# EasyEDA Pro project SCH_and_PCB.epro, schematic Schematic1
Create Date: 2023-07-26; Page Name: P1; Project Name: 四路运放; Schematic Name: Schematic1; Update Date: 2023-07-27; Company: 嘉立创EDA; Page Size: A4; Version: V1.0
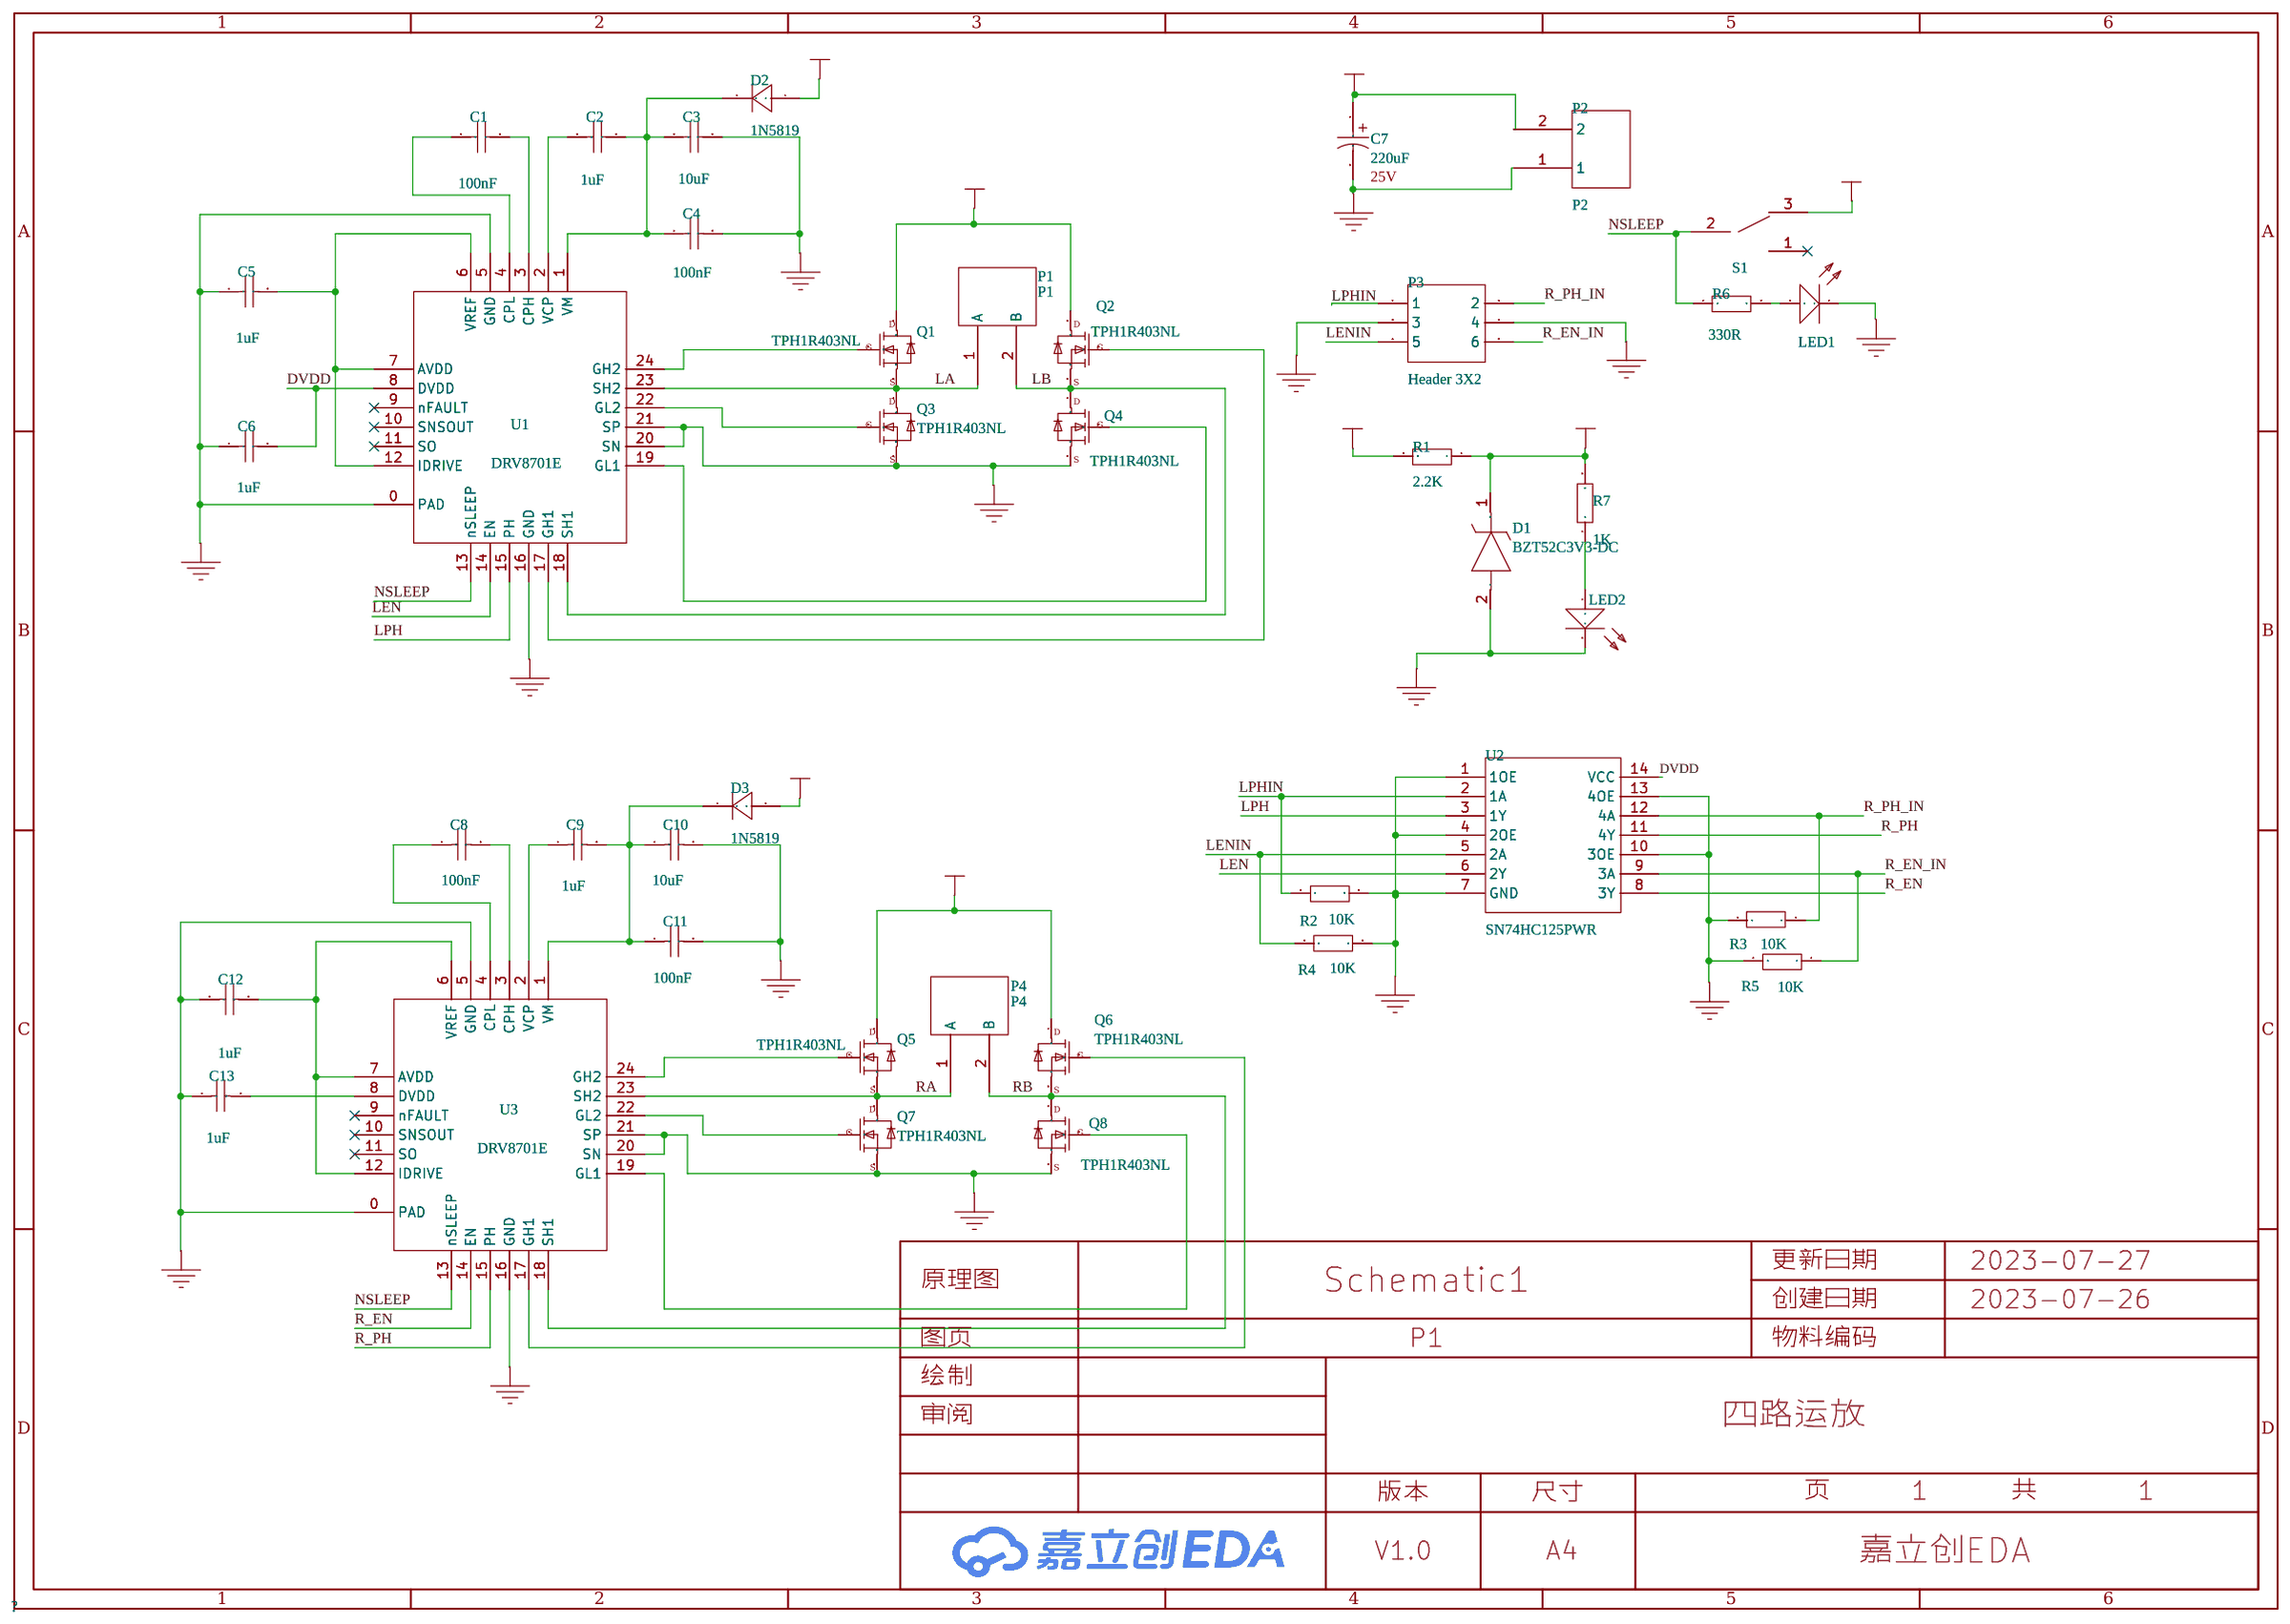
[diagram p0: schematic sheet]

## Parts
C1  100nF  [C 0805_M]
C2  1uF  [C 0805_M]
C3  10uF  [C 0805_M]
C4  100nF  [C 0805_M]
C5  1uF  [C 0805_M]
C6  1uF  [C 0805_M]
C7  220uF  [CAP-D8.0-F3.5]
C8  100nF  [C 0805_M]
C9  1uF  [C 0805_M]
C10  10uF  [C 0805_M]
C11  100nF  [C 0805_M]
C12  1uF  [C 0805_M]
C13  1uF  [C 0805_M]
D1  BZT52C3V3-DC  [SOD3816X140N]
D2  1N5819  [SOD-123]
D3  1N5819  [SOD-123]
LED1  LED 3R  [LED 0805G]
LED2  LED 3R  [LED 0805G]
P1  P1  [KF/WJ/DG 301-2P-5.0MM]
P2  P2  [KF/WJ/DG 301-2P-5.0MM]
P3  Header 3X2  [HDR2.54-LI-2X3P]
P4  P4  [KF/WJ/DG 301-2P-5.0MM]
Q1  TPH1R403NL  [DFN5X6]
Q2  TPH1R403NL  [DFN5X6]
Q3  TPH1R403NL  [DFN5X6]
Q4  TPH1R403NL  [DFN5X6]
Q5  TPH1R403NL  [DFN5X6]
Q6  TPH1R403NL  [DFN5X6]
Q7  TPH1R403NL  [DFN5X6]
Q8  TPH1R403NL  [DFN5X6]
R1  2.2K  [R0603]
R2  10K  [R0603]
R3  10K  [R0603]
R4  10K  [R0603]
R5  10K  [R0603]
R6  330R  [R0603]
R7  1K  [R0603]
S1  SW-SPDT  [SS-12D10]
U1  DRV8701E  [QFN24-4X4]
U2  SN74HC125PWR  [TSSOP14]
U3  DRV8701E  [QFN24-4X4]

## Library data of the parts
C1 = 100nF: Published: 8-Jun-2000; LatestRevisionDate: 17-Jul-2002; LatestRevisionNote: Re-released for DXP Platform.; PackageReference: RAD-0.3; Publisher: Altium Limited; PackageDescription: Radial Cap, Thru-Hole; 2 Leads; 0.3 in Pin Spacing; Comment: 100nf
C2 = 1uF: Published: 8-Jun-2000; LatestRevisionDate: 17-Jul-2002; LatestRevisionNote: Re-released for DXP Platform.; PackageReference: RAD-0.3; Publisher: Altium Limited; PackageDescription: Radial Cap, Thru-Hole; 2 Leads; 0.3 in Pin Spacing; Comment: 1uf
C3 C10 = 10uF: Published: 8-Jun-2000; LatestRevisionDate: 17-Jul-2002; LatestRevisionNote: Re-released for DXP Platform.; PackageReference: RAD-0.3; Publisher: Altium Limited; PackageDescription: Radial Cap, Thru-Hole; 2 Leads; 0.3 in Pin Spacing; Comment: Cap
C4 C8 C11 = 100nF: Published: 8-Jun-2000; LatestRevisionDate: 17-Jul-2002; LatestRevisionNote: Re-released for DXP Platform.; PackageReference: RAD-0.3; Publisher: Altium Limited; PackageDescription: Radial Cap, Thru-Hole; 2 Leads; 0.3 in Pin Spacing; Comment: Cap
C5 C6 C9 C12 C13 = 1uF: Published: 8-Jun-2000; LatestRevisionDate: 17-Jul-2002; LatestRevisionNote: Re-released for DXP Platform.; PackageReference: RAD-0.3; Publisher: Altium Limited; PackageDescription: Radial Cap, Thru-Hole; 2 Leads; 0.3 in Pin Spacing; Comment: Cap
C7 = 220uF: 3DModel: CAP-D8.0×H11.5×F3.5; Published: 8-Jun-2000; Revision: July-2002: Re-released for DXP Platform.; Publisher: Altium Limited; Price(RMB): 0.000; Voltage: 25V
D1 = BZT52C3V3-DC: Datasheet Link: https://www.tme.eu/it/Document/615b5be1bd360366cd867e80cdd3ea35/BZT52C_SER.pdf; Height: 1.4mm; Manufacturer_Name: DC COMPONENTS CO.
D2 D3 = 1N5819: Published: 8-Jun-2000; Revision: July-2002: Re-released for DXP Platform.; Publisher: Altium Limited; Price(RMB): 0.000; Imax: 500mA
LED1 LED2 = LED 3R: Published: 8-Jun-2000; Revision: July-2002: Re-released for DXP Platform.; Publisher: Altium Limited; Price(RMB): 0.00
P1 = P1
P2 = P2
P3 = Header 3X2: BOM名称: 3*2P接插件; 学习资源: www.ooocke.com; 版权归属: 源创客
P4 = P4
Q1-Q8 = TPH1R403NL
R1 = 2.2K: link: https://www.mouser.in/datasheet/2/447/PYu_RT_1_to_0_01_RoHS_L_11-1669912.pdf; Published: 8-Jun-2000; LatestRevisionDate: 17-Jul-2002; LatestRevisionNote: Re-released for DXP Platform.; PackageReference: AXIAL-0.4; Publisher: Altium Limited; PackageDescription: Axial Device, Thru-Hole; 2 Leads; 0.4 in Pin Spacing; Comment: Res2
R2-R5 = 10K: link: https://www.mouser.in/datasheet/2/447/PYu_RT_1_to_0_01_RoHS_L_11-1669912.pdf; Published: 8-Jun-2000; LatestRevisionDate: 17-Jul-2002; LatestRevisionNote: Re-released for DXP Platform.; PackageReference: AXIAL-0.4; Publisher: Altium Limited; PackageDescription: Axial Device, Thru-Hole; 2 Leads; 0.4 in Pin Spacing; Comment: Res2
R6 = 330R: link: https://www.mouser.in/datasheet/2/447/PYu_RT_1_to_0_01_RoHS_L_11-1669912.pdf; Published: 8-Jun-2000; LatestRevisionDate: 17-Jul-2002; LatestRevisionNote: Re-released for DXP Platform.; PackageReference: AXIAL-0.4; Publisher: Altium Limited; PackageDescription: Axial Device, Thru-Hole; 2 Leads; 0.4 in Pin Spacing; Comment: Res2
R7 = 1K: link: https://www.mouser.in/datasheet/2/447/PYu_RT_1_to_0_01_RoHS_L_11-1669912.pdf; Published: 8-Jun-2000; LatestRevisionDate: 17-Jul-2002; LatestRevisionNote: Re-released for DXP Platform.; PackageReference: AXIAL-0.4; Publisher: Altium Limited; PackageDescription: Axial Device, Thru-Hole; 2 Leads; 0.4 in Pin Spacing; Comment: Res2
S1 = SW-SPDT: Published: 24-Mar-1999; Publisher: Altium Limited; Price(RMB): 0.000
U1 U3 = DRV8701E
U2 = SN74HC125PWR: Datasheet Link: https://componentsearchengine.com/Datasheets/2/SN74HC125PWR.pdf; Height: 1.2mm; Manufacturer_Name: Texas Instruments; Mouser Part Number: 595-SN74HC125PWR; Mouser Price/Stock: https://www.mouser.com/Search/Refine.aspx?Keyword=595-SN74HC125PWR

## Nets
3V3: D1.1(K) R1.1 R7.2 S1.3
DVDD: C6.2 U1.8(DVDD) U2.14(VCC)
GND: C3.2 C4.2 C5.1 C6.1 C7.2 C10.2 C11.2 C12.1 C13.1 D1.2(A) LED1.2(K) LED2.2(K) P2.1 P3.3 P3.4 Q3.3(S) Q4.3(S) Q7.3(S) Q8.3(S) R2.2 R3.2 R4.2 R5.2 U1.0(PAD) U1.5(GND) U1.16(GND) U1.20(SN) U1.21(SP) U2.1(1OE) U2.4(2OE) U2.7(GND) U2.10(3OE) U2.13(4OE) U3.0(PAD) U3.5(GND) U3.16(GND) U3.20(SN) U3.21(SP)
LA: P1.1(A) Q1.3(S) Q3.1(D) U1.23(SH2)
LB: P1.2(B) Q2.3(S) Q4.1(D) U1.18(SH1)
LEN: U1.14(EN) U2.6(2Y)
LENIN: P3.5 R4.1 U2.5(2A)
LPH: U1.15(PH) U2.3(1Y)
LPHIN: P3.1 R2.1 U2.2(1A)
NSLEEP: R6.1 S1.2 U1.13(nSLEEP) U3.13(nSLEEP)
R_EN: U2.8(3Y) U3.14(EN)
R_EN_IN: P3.6 R5.1 U2.9(3A)
R_PH: U2.11(4Y) U3.15(PH)
R_PH_IN: P3.2 R3.1 U2.12(4A)
RA: P4.1(A) Q5.3(S) Q7.1(D) U3.23(SH2)
RB: P4.2(B) Q6.3(S) Q8.1(D) U3.18(SH1)
VM: C7.1 D2.A D3.A P2.2 Q1.1(D) Q2.1(D) Q5.1(D) Q6.1(D) R1.2
Net-(C1-1): C1.1 U1.4(CPL)
Net-(C1-2): C1.2 U1.3(CPH)
Net-(C2-1): C2.1 U1.2(VCP)
Net-(C2-2): C2.2 C3.1 C4.1 D2.K U1.1(VM)
Net-(C5-2): C5.2 U1.6(VREF) U1.7(AVDD) U1.12(IDRIVE)
Net-(C8-1): C8.1 U3.4(CPL)
Net-(C8-2): C8.2 U3.3(CPH)
Net-(C9-1): C9.1 U3.2(VCP)
Net-(C9-2): C9.2 C10.1 C11.1 D3.K U3.1(VM)
Net-(C12-2): C12.2 U3.6(VREF) U3.7(AVDD) U3.12(IDRIVE)
Net-(C13-2): C13.2 U3.8(DVDD)
Net-(LED1-1): LED1.1(A) R6.2
Net-(LED2-1): LED2.1(A) R7.1
Net-(Q1-2): Q1.2(G) U1.24(GH2)
Net-(Q2-2): Q2.2(G) U1.17(GH1)
Net-(Q3-2): Q3.2(G) U1.22(GL2)
Net-(Q4-2): Q4.2(G) U1.19(GL1)
Net-(Q5-2): Q5.2(G) U3.24(GH2)
Net-(Q6-2): Q6.2(G) U3.17(GH1)
Net-(Q7-2): Q7.2(G) U3.22(GL2)
Net-(Q8-2): Q8.2(G) U3.19(GL1)

Not connected (* = marked no-connect by the designer): S1 1*; U1 9(nFAULT)* 10(SNSOUT)* 11(SO)*; U3 9(nFAULT)* 10(SNSOUT)* 11(SO)*
